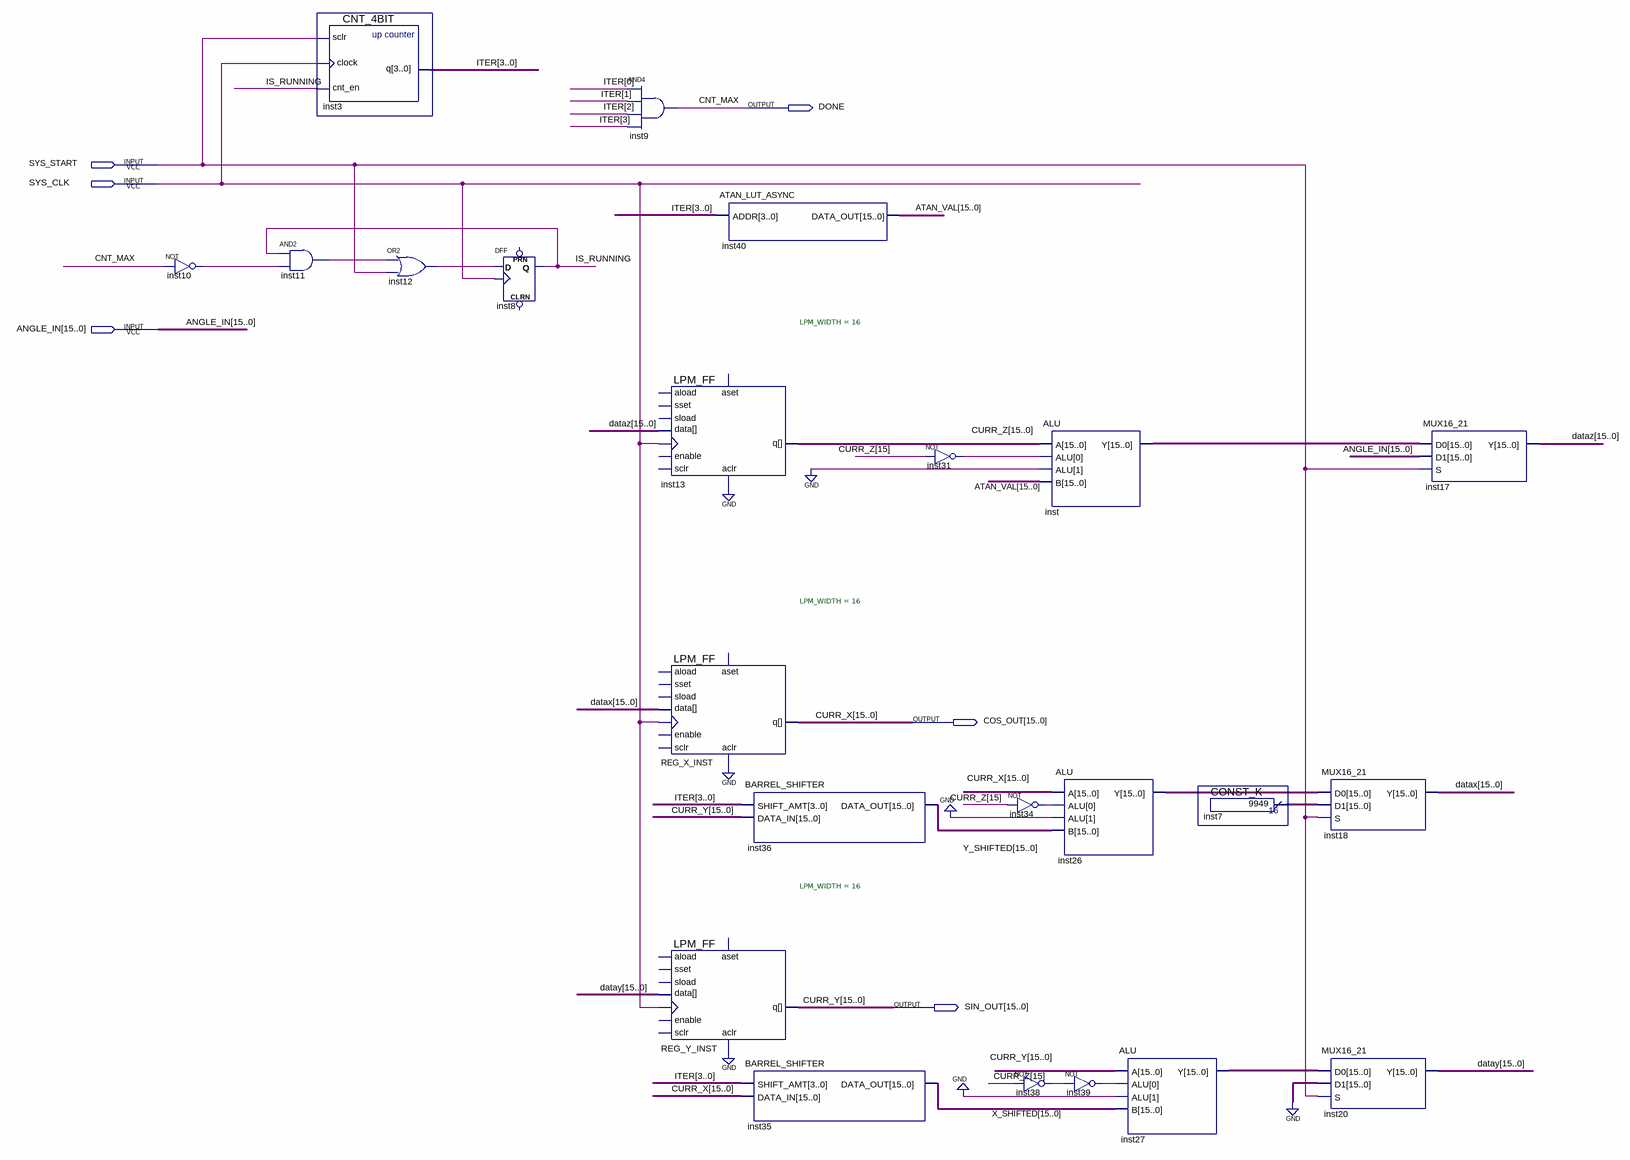
[diagram p0: schematic sheet]
// Quartus schematic CORDIC_SINCOS.bdf as structural Verilog: 23 symbols, 6 pins
module CORDIC_SINCOS (
  input  SYS_START,
  input  SYS_CLK,
  input  [15:0] ANGLE_IN,
  output DONE,
  output [15:0] COS_OUT,
  output [15:0] SIN_OUT
);

  wire inst10_out, inst11_out, inst12_out, inst31_out, inst34_out, inst38_out, inst39_out, IS_RUNNING;
  wire [3:0] ITER;
  wire [15:0] ATAN_VAL, CURR_Z, datax, datay, dataz, inst7_result, inst26_y, inst27_y, inst_y, X_SHIFTED,
       Y_SHIFTED;

  not inst10 (inst10_out, DONE);
  and inst11 (inst11_out, IS_RUNNING, inst10_out);
  CNT_4BIT inst3 (.sclr(SYS_START), .clock(SYS_CLK), .cnt_en(IS_RUNNING), .q(ITER));
  or inst12 (inst12_out, inst11_out, SYS_START);
  DFF inst8 (.CLK(SYS_CLK), .D(inst12_out), .Q(IS_RUNNING));  // open: CLRN, PRN
  and inst9 (DONE, ITER[0], ITER[1], ITER[2], ITER[3]);
  LPM_FF #(.LPM_WIDTH(16)) inst13 (
    .clock(SYS_CLK), .aclr(1'b0), .data(dataz), .q(CURR_Z));  // open: enable, aload, sset, sload, aset, sclr
  LPM_FF #(.LPM_WIDTH(16)) REG_X_INST (
    .clock(SYS_CLK), .aclr(1'b0), .data(datax), .q(COS_OUT));  // open: enable, aload, sset, sload, aset, sclr
  LPM_FF #(.LPM_WIDTH(16)) REG_Y_INST (
    .clock(SYS_CLK), .aclr(1'b0), .data(datay), .q(SIN_OUT));  // open: enable, aload, sset, sload, aset, sclr
  ATAN_LUT_ASYNC inst40 (.ADDR(ITER), .DATA_OUT(ATAN_VAL));
  BARREL_SHIFTER inst36 (.SHIFT_AMT(ITER), .DATA_IN(SIN_OUT), .DATA_OUT(Y_SHIFTED));
  BARREL_SHIFTER inst35 (.SHIFT_AMT(ITER), .DATA_IN(COS_OUT), .DATA_OUT(X_SHIFTED));
  not inst31 (inst31_out, CURR_Z[15]);
  ALU inst (.A(CURR_Z), .ALU({1'b0, inst31_out}), .B(ATAN_VAL), .Y(inst_y));
  not inst34 (inst34_out, CURR_Z[15]);
  not inst38 (inst38_out, CURR_Z[15]);
  ALU inst26 (.A(COS_OUT), .ALU({1'b0, inst34_out}), .B(Y_SHIFTED), .Y(inst26_y));
  not inst39 (inst39_out, inst38_out);
  ALU inst27 (.A(SIN_OUT), .ALU({1'b0, inst39_out}), .B(X_SHIFTED), .Y(inst27_y));
  CONST_K inst7 (.result(inst7_result));
  MUX16_21 inst18 (.D0(inst26_y), .D1(inst7_result), .S(SYS_START), .Y(datax));
  MUX16_21 inst20 (.D0(inst27_y), .D1({16{1'b0}}), .S(SYS_START), .Y(datay));
  MUX16_21 inst17 (.D0(inst_y), .D1(ANGLE_IN), .S(SYS_START), .Y(dataz));

  // Other names for the same wires on the sheet: CNT_MAX = DONE; CURR_X[15:0] = COS_OUT; CURR_Y[15:0] = SIN_OUT
endmodule
